# EAGLE design range_anchor (EAGLE 8.2.2)
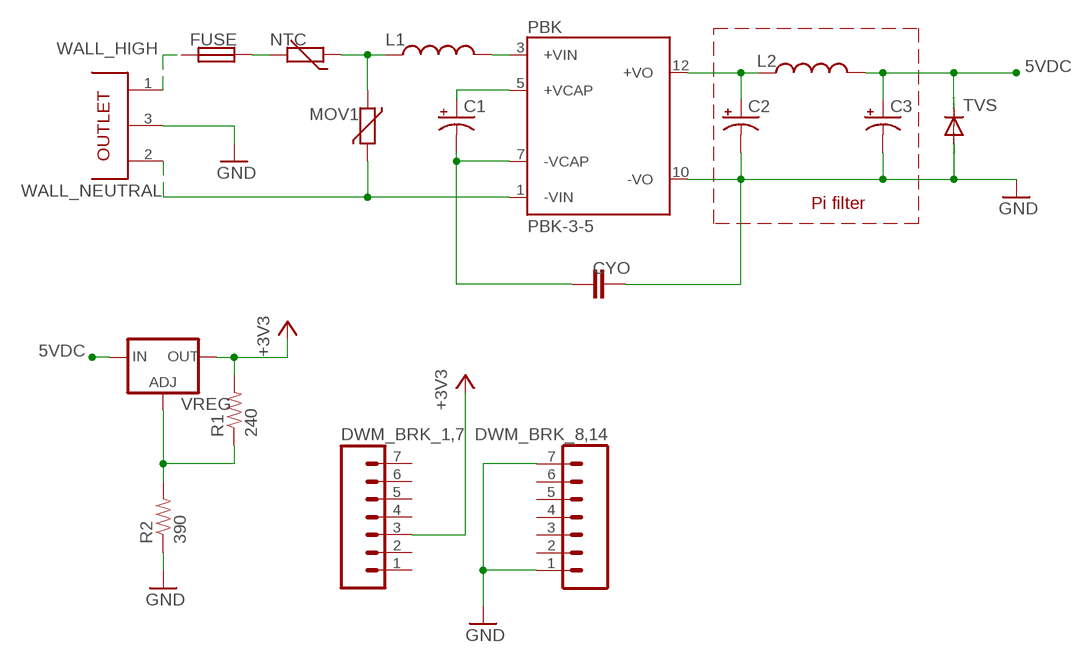
[diagram p0: schematic, sheet 1]

## Parts
C1  CAP_POLPTH2  [CPOL-RADIAL-10UF-25V]
C2  CAP_POLPTH2  [CPOL-RADIAL-10UF-25V]
C3  CAP_POLPTH2  [CPOL-RADIAL-10UF-25V]
CYO  CAPPTH3  [CAP-PTH-LARGE]
DWM_BRK_1,7  M07LOCK  [1X07_LOCK]
DWM_BRK_8,14  M07LOCK  [1X07_LOCK]
FUSE  FUSESMD  [2-SMD]
L1  INDUCTORAXIAL-0.6  [AXIAL-0.6]
L2  INDUCTORAXIAL-0.6  [AXIAL-0.6]
MOV1  VARISTOR-2,5  [R-5]
NTC  THERMISTOR-7,5  [R-7,5]
PBK  PBK-3-5  [3-5-VERTICAL]
R1  240  RESISTOR1206  [1206]
R2  390  RESISTOR1206  [1206]
TVS  DIODE-DO214AA  [DO214AA]
VREG  V_REG_317DPACK  [V-REG_DPACK]
WALL  OUTLET  [OUTLET]

## Nets
3V3: DWM_BRK_1,7.3 R1.2 VREG.4(OUT) ; supply symbol labelled +3V3
5VDC: C3.1(+) L2.P$2 TVS.C VREG.3(IN)
GND: C2.2(-) C3.2(-) CYO.2 DWM_BRK_8,14.1 DWM_BRK_8,14.7 PBK.10(-VO) R2.1 TVS.A WALL.3(GND)
N$1: FUSE.2 NTC.2
N$2: L1.P$1 MOV1.1 NTC.1
N$3: L1.P$2 PBK.3(+VIN)
N$4: C1.1(+) PBK.5(+VCAP)
N$5: C1.2(-) CYO.1 PBK.7(-VCAP)
N$7: R1.1 R2.2 VREG.1(ADJ)
N$8: C2.1(+) L2.P$1 PBK.12(+VO)
WALL_HIGH: FUSE.1 WALL.1(HIGH)
WALL_NEUTRAL: MOV1.2 PBK.1(-VIN) WALL.2(NEUTRAL)
Unconnected: DWM_BRK_1,7.1 DWM_BRK_1,7.2 DWM_BRK_1,7.4 DWM_BRK_1,7.5 DWM_BRK_1,7.6 DWM_BRK_1,7.7 DWM_BRK_8,14.2 DWM_BRK_8,14.3 DWM_BRK_8,14.4 DWM_BRK_8,14.5 DWM_BRK_8,14.6

## Notes on the sheet
- Pi filter

## Library data of the parts
C1-C3 = SparkFun-Passives:CAP_POL: Capacitor Polarized These are standard SMD and PTH capacitors. Normally 10uF, 47uF, and 100uF in electrolytic and tantalum varieties. Always verify the external diameter of the through hole cap, it varies with capacity, voltage, and manufacturer. The EIA devices should be standard.
CYO = SparkFun-Capacitors:CAP: Capacitor Standard 0603 ceramic capacitor, and 0.1" leaded capacitor.
DWM_BRK_1,7 DWM_BRK_8,14 = SparkFun-Connectors:M07: Header 7 Standard 7-pin 0.1" header. Use with straight break away headers (SKU : PRT-00116), right angle break away headers (PRT-00553), swiss pins (PRT-00743), machine pins (PRT-00117), and female headers (PRT-00115). NOTES ON THE VARIANTS LOCK and LOCK_LONGPADS... This footprint was designed to help hold the alignment of a through-hole component (i.e. 7-pin header) while soldering it into place. You may notice that each hole has been shifted either up or down by 0.005 of an inch from it's more standard position (which is usually a perfectly straight line). This slight alteration caused the pins (the squares in the middle) to touch the edges of the holes. Because they are alternating, it causes a "brace" to hold the header in place. 0.005 has proven to be the perfect amount of "off-center" position when using our standard breakaway headers. Although looks a little odd when you look at the bare footprint, once you have a header in there, the alteration is very hard to notice. Also, if you push a header all the way into place, it is covered up entirely on the bottom side. This idea of altering the position of holes to aid alignment will be further integrated into the Sparkfun Library for other footprints. It can help hold any component with 3 or more connection pins.
FUSE = custom:FUSE: Radial fast acting fuse http://www.littelfuse.com/~/media/electronics/datasheets/fuses/littelfuse_fuse_370_datasheet.pdf.pdf
L1 L2 = SparkFun-Passives:INDUCTOR: Inductors Basic Inductor/Choke - 0603 and 1206. Footprints are not proven and vary greatly between part numbers. SRN6045- 33uH, 20% 1.4A SDR0403-560KL - 56uH, 10%, 500mA RMS/740mA peak
MOV1 = custom:VARISTOR: VARISTOR
NTC = custom:THERMISTOR: THERMISTOR
PBK = custom:PBK-3-5: AC-DC Power Supply
R1 R2 = SparkFun-Passives:RESISTOR: Resistor Basic schematic elements and footprints for 0603, 1206, and PTH resistors.
TVS = diode:DIODE-: DIODE
VREG = custom:V_REG_317: Voltage Regulator Standard LM317 adjustable voltage regulator. AOI (Adjust Output Input). Google 'LM317 Calculator' for easy to use app to get the two resistor values needed. 240/720 for 5V output. 240/390 for 3.3V output. Spark Fun Electronics SKU : COM-00527
WALL = custom:OUTLET

## Board
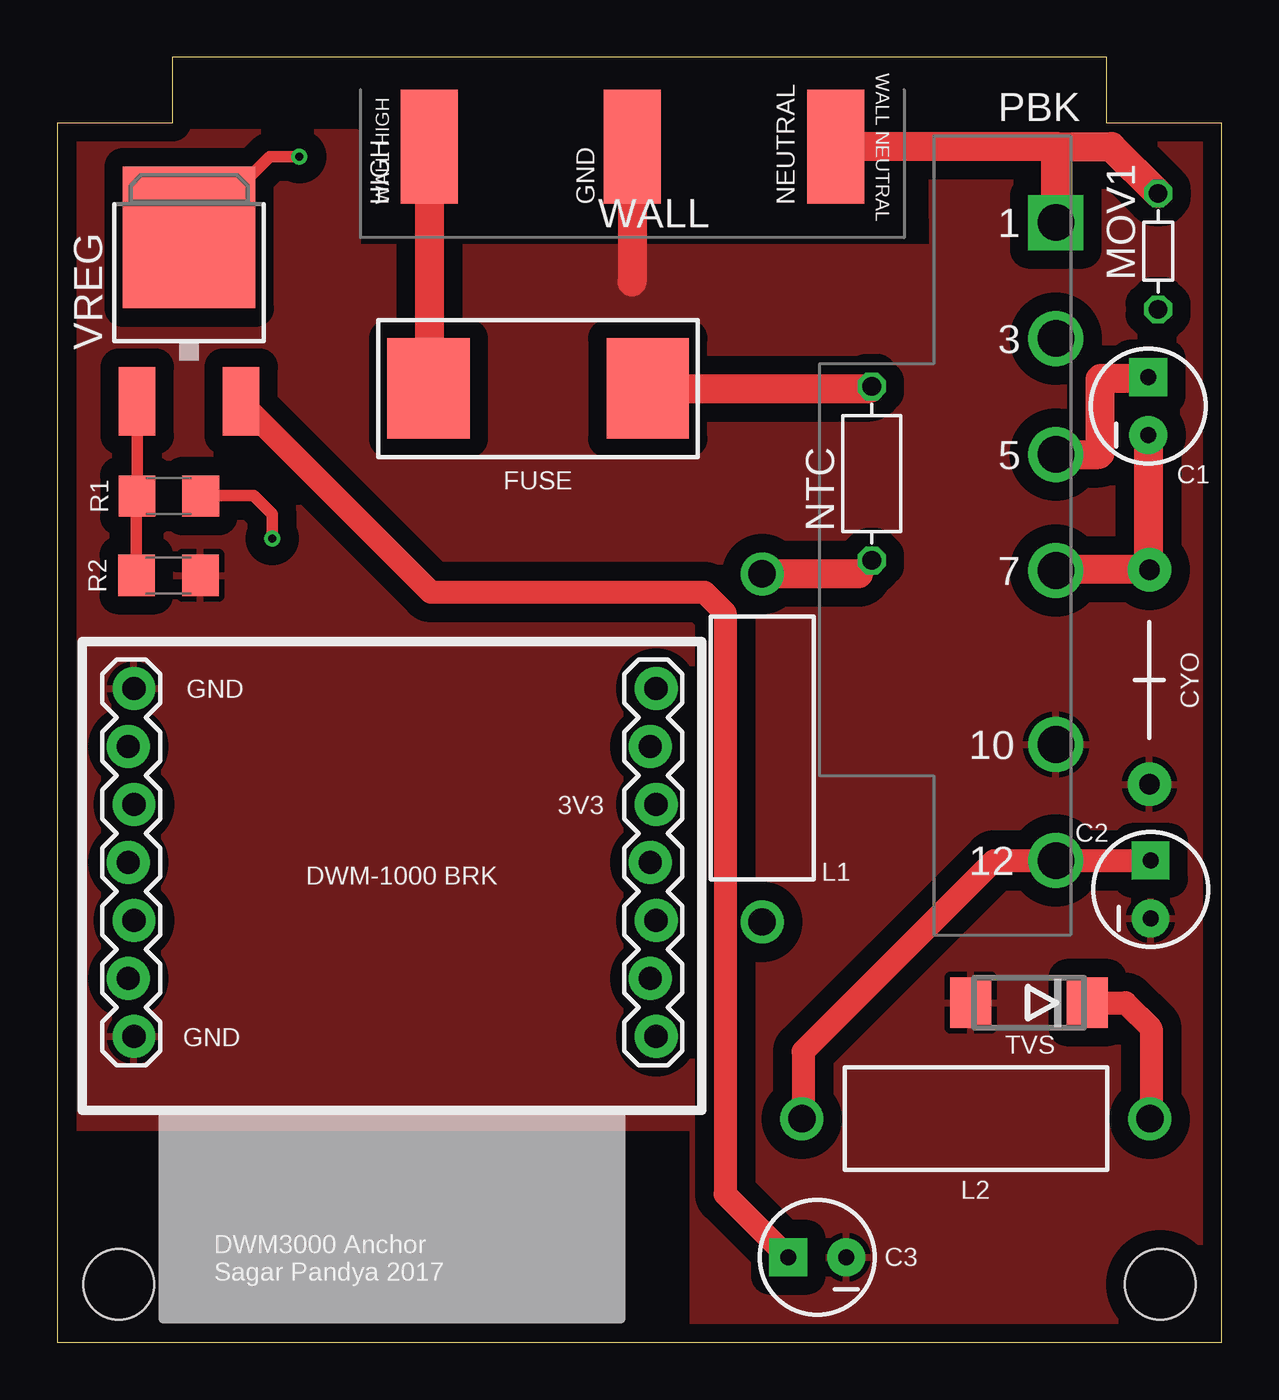
[diagram p1: board, top side]
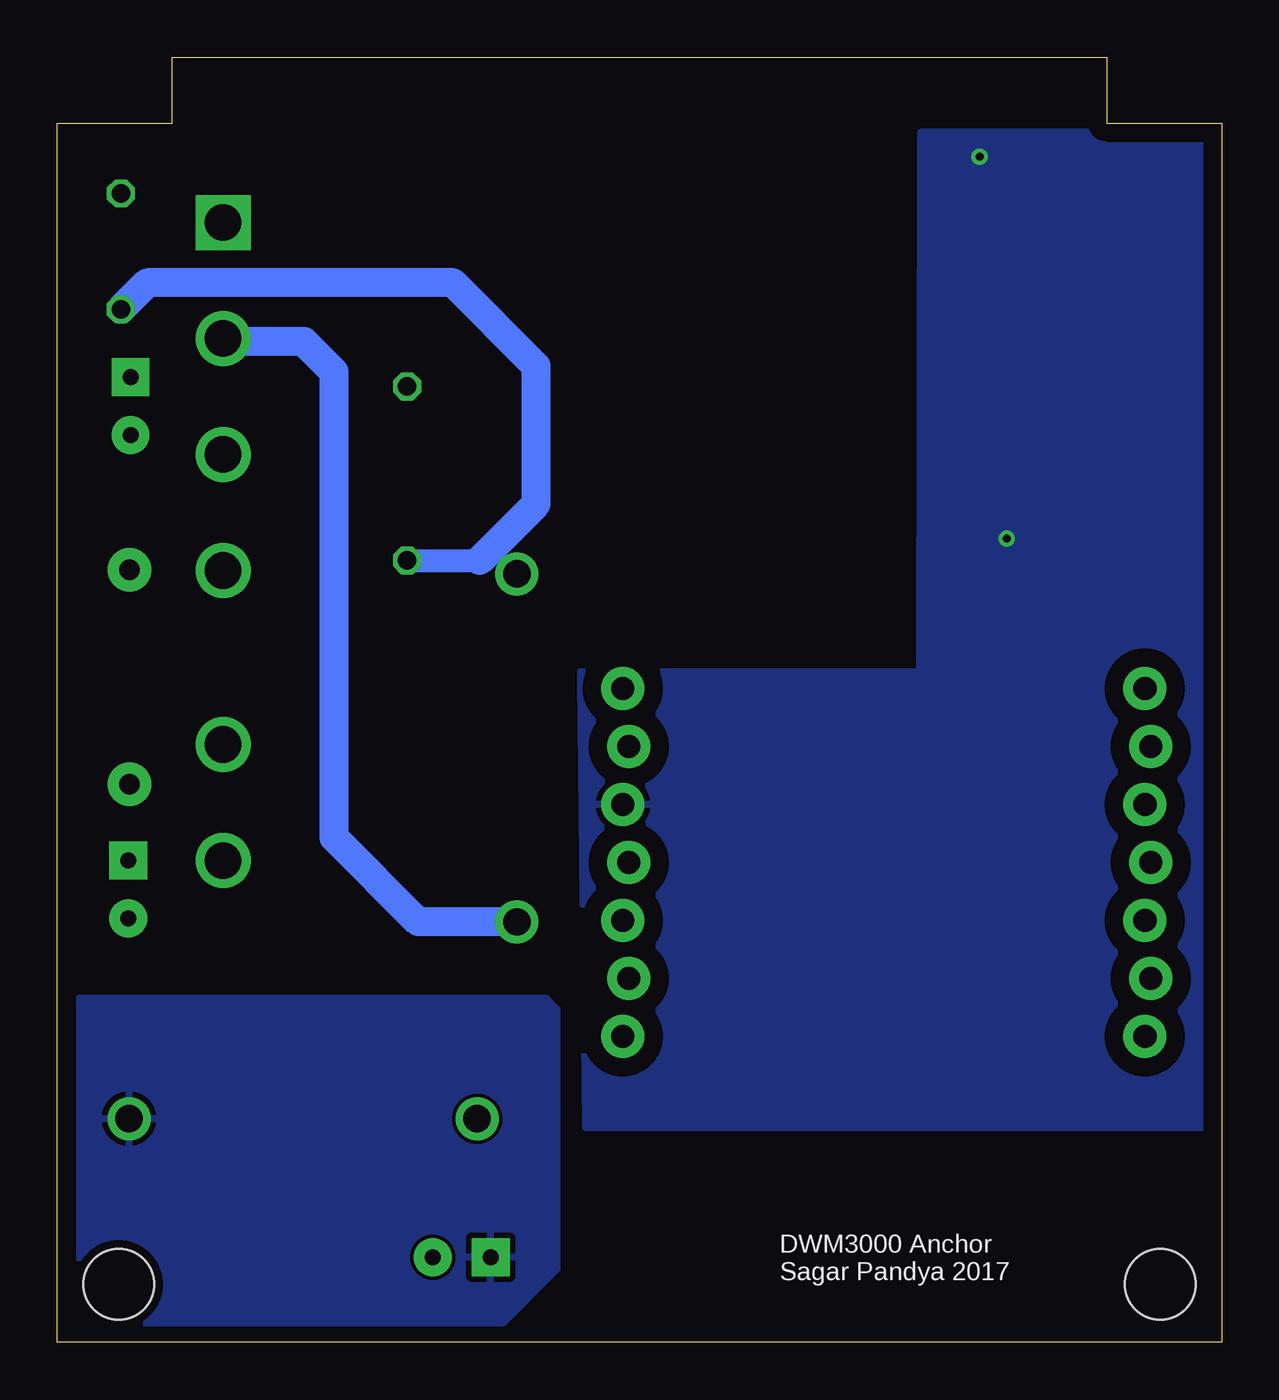
[diagram p2: board, bottom side, seen from below]

Size 51 x 56.3 mm. Coordinates in mm from the lower left corner, seen from the top.
Outline: 0,0 51,0 51,53.41 45.95,53.41 45.95,56.3 5.05,56.3 5.05,53.41 0,53.41 0,0
Copper layers (1*16): Top 0.0356mm / dielectric 1.5011mm / Bottom 0.0356mm
Design rules "LaenPCBOrder": minimum track width 6mil, minimum drill 13mil, track to track 6mil, track to pad 6mil, pad to pad 6mil, via to via 6mil, smd to smd 6mil, copper to edge 15mil, drill to drill 6mil, minimum pad ring 7mil, minimum via ring 7mil, stop-mask expansion 3mil, vias tented up to drill 0mil, thermal gap 10mil
Holes 3.1 mm at 2.7,2.55 48.3,2.55

### Footprints (pad centres in the part's own frame; a part is rotated, then mirrored left to right if it is on the bottom)
CPOL-RADIAL-10UF-25V = drill 0.7 pad 1.651 square: 1 1.27,0 | drill 0.7 pad 1.651: 2 -1.27,0
CAP-PTH-LARGE = drill 0.9 pad 1.905: 1 -4.826,0; 2 4.572,0
1X07_LOCK = drill 1.016 pad 1.88: 1 0,0.127; 2 2.54,-0.127; 3 5.08,0.127; 4 7.62,-0.127; 5 10.16,0.127; 6 12.7,-0.127; 7 15.24,0.127
2-SMD = smd 3.6 x 4.4: 1 -4.8,0; 2 4.8,0
AXIAL-0.6 = drill 1.2 pad 1.88: P$1 -7.62,0; P$2 7.62,0
R-5 = drill 0.813 octagon: 1 -2.54,0; 2 2.54,0
R-7,5 = drill 0.813 octagon: 1 -3.81,0; 2 3.81,0
3-5-VERTICAL = drill 1.6 square: 1 0,0 | drill 1.6: 3 5.08,0; 5 10.16,0; 7 15.24,0; 10 22.86,0; 12 27.94,0
1206 = smd 1.6 x 1.8: 1 -1.4,0; 2 1.4,0
DO214AA = smd 1.8 x 2.2: A 2.55,0; C -2.55,0
V-REG_DPACK = smd 1.6 x 3: 1 -2.28,-4.8; 3 2.28,-4.8 | smd 5.8 x 6.2: 4 0,2.38
OUTLET = smd 2.5 x 5: 1 0,0; 2 17.8,0; 3 8.89,0

### Placement (x,y rotation side)
C1  47.78,41.01 90 top
C2  47.88,19.84 90 top
C3  33.28,3.73 180 top
CYO  47.83,29.02 270 top
DWM_BRK_1,7  26.1,28.64 270 top
DWM_BRK_8,14  3.24,28.64 270 top
FUSE  21.06,41.78 0 top
L1  30.87,26.04 270 top
L2  40.23,9.8 0 top
MOV1  48.21,47.79 90 top
NTC  35.67,38.06 90 top
PBK  43.73,49.05 270 top
R1  4.89,37.07 0 top
R2  4.87,33.6 180 top
TVS  42.56,14.88 180 top
VREG  5.78,46.02 0 top
WALL  16.29,52.38 0 top

### Tracks (layer width: path | path; a pad name or v marks a point on that pad's centre or on a via)
3V3  (via drill 0.35)
  Top 0.508: R1.2 6.32,37.1 8.6,37.1 9.42,36.28 v9.42,35.21 | VREG.4 9.32,51.94 v10.61,51.94
  pour Bottom (isolate 0.813): 13.2,53 13.26,29.37 28.1,29.37 28.1,29.06 27.87,9.41 0.83,9.41 0.77,53
5VDC
  Top 1.016: VREG.3 8.06,41.17 16.37,32.86 28.34,32.86 29.25,31.95 29.25,6.49 C3.1 | TVS.C 46.77,14.88 47.9,13.75 47.9,9.85 L2.P$2
  pour Bottom: 50.04,15.07 50.04,1.6 49.31,0.87 31.45,0.87 29.09,3.23 29.09,14.57 29.59,15.07
GND
  Top 1.016: 25.18,46.45 25.09,46.36
  Top 1.27: WALL.3 25.18,46.45
  pour Top (isolate 0.813): 0.78,53 13.11,53 13.15,47.97 38.34,47.97 38.3,53 50.61,53 50.61,0.42 27.85,0.42 27.85,9.39 0.8,9.39
N$1
  Top 1.016: 35.58,41.78 NTC.2
  Top 1.27: FUSE.2 35.58,41.78
N$2
  Top 1.016: 35.08,33.66 NTC.1
  Top 1.27: 35.08,33.66 L1.P$1
  Bottom 1.016: NTC.1 32.5,34.25
  Bottom 1.27: 32.5,34.25 30.02,36.73 30.02,42.77 33.66,46.41 47.05,46.41 MOV1.1
N$3
  Bottom 1.016: 43.6,43.84 PBK.3
  Bottom 1.27: L1.P$2 35.18,18.42 38.87,22.11 38.87,42.51 40.2,43.84 43.6,43.84
N$4
  Top 1.016: 45.62,38.89 45.67,38.94 | 45.67,42.19 45.71,42.23 | 47.73,42.23 C1.1
  Top 1.27: PBK.5 45.62,38.89 | 45.67,38.94 45.67,42.19 | 45.71,42.23 47.73,42.23
N$5
  Top 1.016: 43.77,33.85 PBK.7 | 47.78,33.9 CYO.1
  Top 1.27: CYO.1 43.77,33.85 | C1.2 47.78,33.9
N$7
  Top 0.508: VREG.1 R1.1 3.47,37.05 R2.2
N$8
  Top 1.016: L2.P$1 32.66,9.85 32.66,12.74 41.03,21.11 PBK.12 C2.1
WALL_HIGH
  Top 1.016: 16.29,41.81 FUSE.1
  Top 1.27: WALL.1 16.29,41.81
WALL_NEUTRAL
  Top 1.016: 43.73,52.36 43.75,52.38
  Top 1.27: WALL.2 43.75,52.38 46.16,52.38 MOV1.2 | PBK.1 43.73,52.36

### Text on the board
tPlace: GND | 3V3 | DWM-1000 BRK | GND
tNames: WALL HIGH | WALL NEUTRAL | DWM3000 Anchor / Sagar Pandya 2017
bNames: DWM3000 Anchor / Sagar Pandya 2017